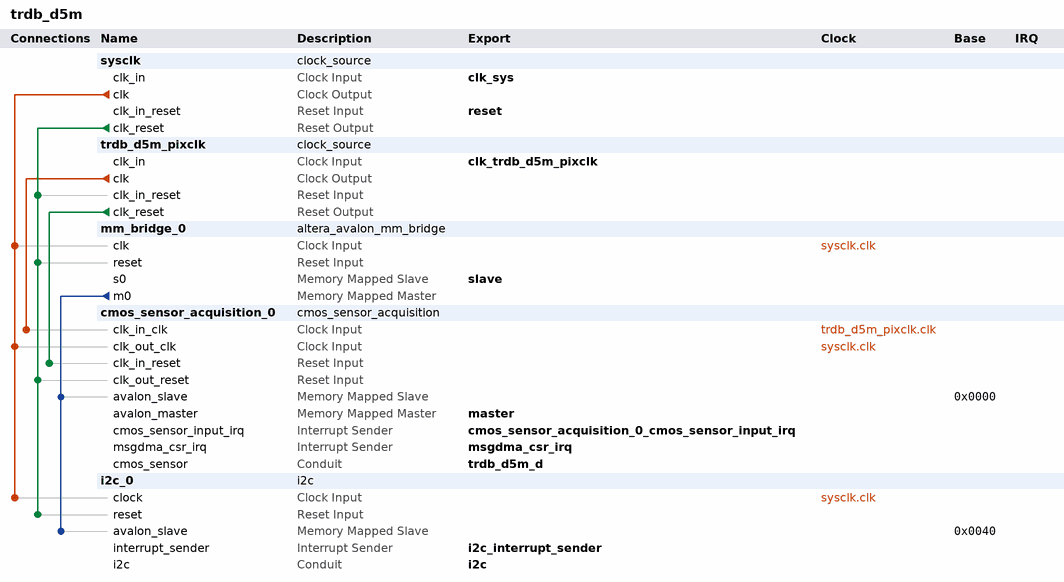
[diagram p0: system contents]
# Platform Designer (Qsys) system trdb_d5m, Cyclone V 5CSEMA5F31C6
# Parameters at their usual value, and those the tool derives, are not listed.
package require -exact qsys 20.1
create_system trdb_d5m
set_project_property DEVICE_FAMILY {Cyclone V}
set_project_property DEVICE 5CSEMA5F31C6

add_instance sysclk clock_source 20.1
set_instance_parameter_value sysclk clockFrequency 50000000

add_instance trdb_d5m_pixclk clock_source 20.1
set_instance_parameter_value trdb_d5m_pixclk clockFrequency 10000000

add_instance mm_bridge_0 altera_avalon_mm_bridge 20.1
set_instance_parameter_value mm_bridge_0 ADDRESS_UNITS SYMBOLS
set_instance_parameter_value mm_bridge_0 ADDRESS_WIDTH 10
set_instance_parameter_value mm_bridge_0 DATA_WIDTH 32
set_instance_parameter_value mm_bridge_0 MAX_PENDING_RESPONSES 4
set_instance_parameter_value mm_bridge_0 USE_AUTO_ADDRESS_WIDTH 1

add_instance cmos_sensor_acquisition_0 cmos_sensor_acquisition 20.1
set_instance_parameter_value cmos_sensor_acquisition_0 CLK_IN_CLOCK_FREQUENCY 10000000
set_instance_parameter_value cmos_sensor_acquisition_0 CLK_OUT_CLOCK_FREQUENCY 50000000
set_instance_parameter_value cmos_sensor_acquisition_0 CMOS_SENSOR_INPUT_DEBAYER_ENABLE true
set_instance_parameter_value cmos_sensor_acquisition_0 CMOS_SENSOR_INPUT_DEVICE_FAMILY {Cyclone V}
set_instance_parameter_value cmos_sensor_acquisition_0 CMOS_SENSOR_INPUT_FIFO_DEPTH 32
set_instance_parameter_value cmos_sensor_acquisition_0 CMOS_SENSOR_INPUT_MAX_HEIGHT 1944
set_instance_parameter_value cmos_sensor_acquisition_0 CMOS_SENSOR_INPUT_MAX_WIDTH 2592
set_instance_parameter_value cmos_sensor_acquisition_0 CMOS_SENSOR_INPUT_OUTPUT_WIDTH 32
set_instance_parameter_value cmos_sensor_acquisition_0 CMOS_SENSOR_INPUT_PACKER_ENABLE false
set_instance_parameter_value cmos_sensor_acquisition_0 CMOS_SENSOR_INPUT_PIX_DEPTH 8
set_instance_parameter_value cmos_sensor_acquisition_0 CMOS_SENSOR_INPUT_SAMPLE_EDGE FALLING
set_instance_parameter_value cmos_sensor_acquisition_0 DC_FIFO_DEPTH 16
set_instance_parameter_value cmos_sensor_acquisition_0 DC_FIFO_WIDTH 64
set_instance_parameter_value cmos_sensor_acquisition_0 MSGDMA_BURST_ENABLE 1
set_instance_parameter_value cmos_sensor_acquisition_0 MSGDMA_DATA_FIFO_DEPTH 64
set_instance_parameter_value cmos_sensor_acquisition_0 MSGDMA_DATA_WIDTH 64
set_instance_parameter_value cmos_sensor_acquisition_0 MSGDMA_DESCRIPTOR_FIFO_DEPTH 8
set_instance_parameter_value cmos_sensor_acquisition_0 MSGDMA_MAX_BURST_COUNT 16
set_instance_parameter_value cmos_sensor_acquisition_0 MSGDMA_MAX_BYTE 8388608

add_instance i2c_0 i2c 20.1

# connections
add_connection sysclk.clk cmos_sensor_acquisition_0.clk_out_clk clock
add_connection sysclk.clk i2c_0.clock clock
add_connection sysclk.clk mm_bridge_0.clk clock
add_connection trdb_d5m_pixclk.clk cmos_sensor_acquisition_0.clk_in_clk clock
add_connection sysclk.clk_reset cmos_sensor_acquisition_0.clk_out_reset reset
add_connection sysclk.clk_reset i2c_0.reset reset
add_connection sysclk.clk_reset mm_bridge_0.reset reset
add_connection sysclk.clk_reset trdb_d5m_pixclk.clk_in_reset reset
add_connection trdb_d5m_pixclk.clk_reset cmos_sensor_acquisition_0.clk_in_reset reset
add_connection mm_bridge_0.m0 cmos_sensor_acquisition_0.avalon_slave avalon
set_connection_parameter_value mm_bridge_0.m0/cmos_sensor_acquisition_0.avalon_slave baseAddress 0x0000
add_connection mm_bridge_0.m0 i2c_0.avalon_slave avalon
set_connection_parameter_value mm_bridge_0.m0/i2c_0.avalon_slave baseAddress 0x0040

# exported interfaces
add_interface clk_sys clock sink
set_interface_property clk_sys EXPORT_OF sysclk.clk_in
add_interface clk_trdb_d5m_pixclk clock sink
set_interface_property clk_trdb_d5m_pixclk EXPORT_OF trdb_d5m_pixclk.clk_in
add_interface cmos_sensor_acquisition_0_cmos_sensor_input_irq interrupt sender
set_interface_property cmos_sensor_acquisition_0_cmos_sensor_input_irq EXPORT_OF cmos_sensor_acquisition_0.cmos_sensor_input_irq
add_interface i2c conduit end
set_interface_property i2c EXPORT_OF i2c_0.i2c
add_interface i2c_interrupt_sender interrupt sender
set_interface_property i2c_interrupt_sender EXPORT_OF i2c_0.interrupt_sender
add_interface master avalon master
set_interface_property master EXPORT_OF cmos_sensor_acquisition_0.avalon_master
add_interface msgdma_csr_irq interrupt sender
set_interface_property msgdma_csr_irq EXPORT_OF cmos_sensor_acquisition_0.msgdma_csr_irq
add_interface reset reset sink
set_interface_property reset EXPORT_OF sysclk.clk_in_reset
add_interface slave avalon slave
set_interface_property slave EXPORT_OF mm_bridge_0.s0
add_interface trdb_d5m_d conduit end
set_interface_property trdb_d5m_d EXPORT_OF cmos_sensor_acquisition_0.cmos_sensor

set_interconnect_requirement {$system} qsys_mm.clockCrossingAdapter HANDSHAKE
set_interconnect_requirement {$system} qsys_mm.enableEccProtection FALSE
set_interconnect_requirement {$system} qsys_mm.insertDefaultSlave FALSE
set_interconnect_requirement {$system} qsys_mm.maxAdditionalLatency 1

save_system trdb_d5m.qsys
